# EAGLE design 電源スイッチ (EAGLE 9.6.2)
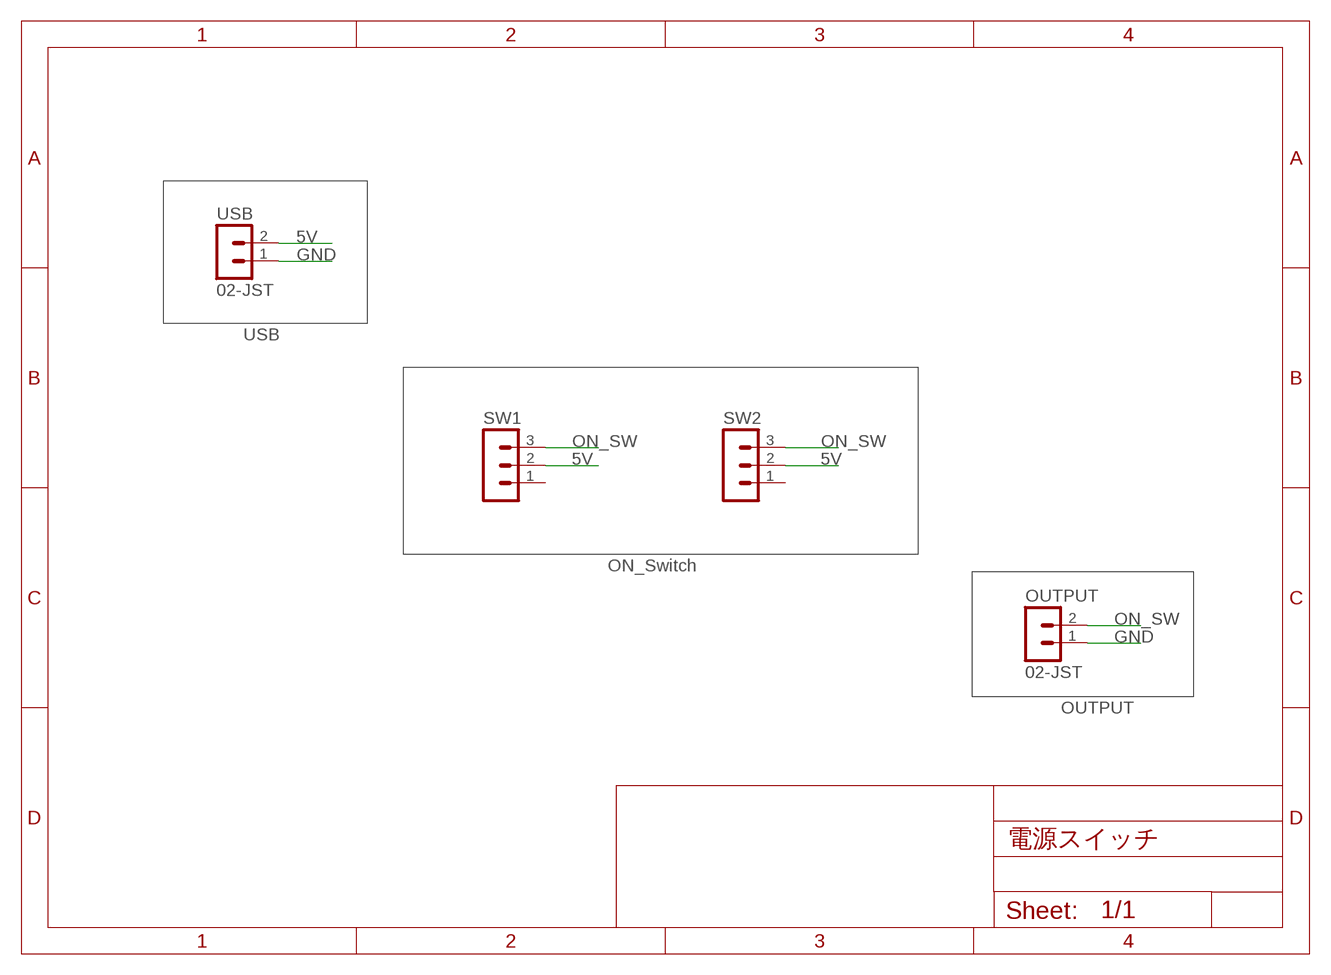
[diagram p0: schematic, sheet 1]

## Parts
OUTPUT  02-JST  [B2B-XH]
SW1  03-JST  [B3B-XH]
SW2  03-JST  [B3B-XH]
USB  02-JST  [B2B-XH]

## Nets
5V: SW1.2 SW2.2 USB.2
GND: OUTPUT.1 USB.1
ON_SW: OUTPUT.2 SW1.3 SW2.3
Unconnected: SW1.1 SW2.1

## Notes on the sheet
- USB
- ON_Switch
- OUTPUT

## Library data of the parts
OUTPUT USB = con-jst-xh:02-JST: JST CONNECTOR
SW1 SW2 = con-jst-xh:03-JST: JST CONNECTOR

## Board
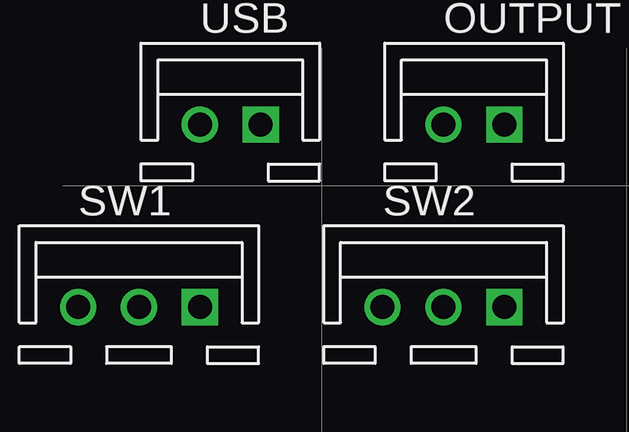
[diagram p1: board, top side]
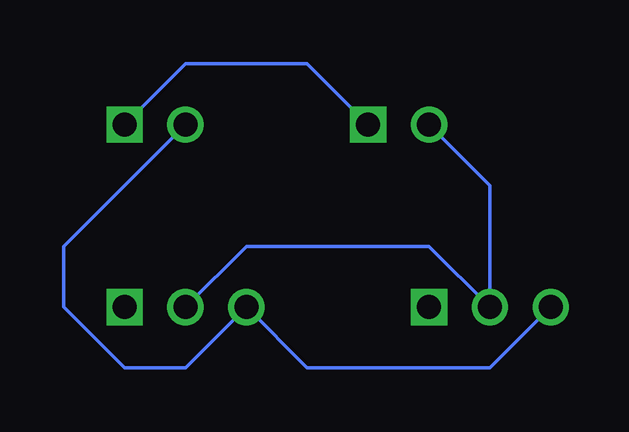
[diagram p2: board, bottom side, seen from below]

No outline drawn. Coordinates in mm, seen from the top.
Copper layers (1*16): Top 0.035mm / dielectric 1.5mm / Bottom 0.035mm
Design rules "default": minimum track width 6mil, minimum drill 0.35mm, track to track 6mil, track to pad 6mil, pad to pad 6mil, via to via 6mil, smd to smd 6mil, copper to edge 40mil, drill to drill 6mil, minimum pad ring 10mil, minimum via ring 8mil, stop-mask expansion 4mil, vias tented up to drill 0mil, thermal gap 10mil

### Footprints (pad centres in the part's own frame; a part is rotated, then mirrored left to right if it is on the bottom)
B2B-XH = drill 1 square: 1 1.27,0 | drill 1: 2 -1.27,0
B3B-XH = drill 1 square: 1 2.54,0 | drill 1: 2 0,0; 3 -2.54,0

### Placement (x,y rotation side)
OUTPUT  19.05,41.91 0 top
SW1  5.08,34.29 0 top
SW2  17.78,34.29 0 top
U$1  [TYPE.C]  0,1.27 0 top
USB  8.89,41.91 0 top

### Tracks (layer width: path | path; a pad name or v marks a point on that pad's centre or on a via)
5V
  Bottom 0.152: SW2.2 15.24,36.83 7.62,36.83 SW1.2 5.08,39.37 USB.2
GND
  Bottom 0.152: USB.1 12.7,44.45 17.78,44.45 OUTPUT.1
ON_SW
  Bottom 0.152: SW1.3 5.08,31.75 12.7,31.75 SW2.3 17.78,31.75 20.32,31.75 22.86,34.29 22.86,36.83 OUTPUT.2